# EAGLE schematic ellipticlock-display-r3 (EAGLE 5.12)

## Sheet 1 of 5
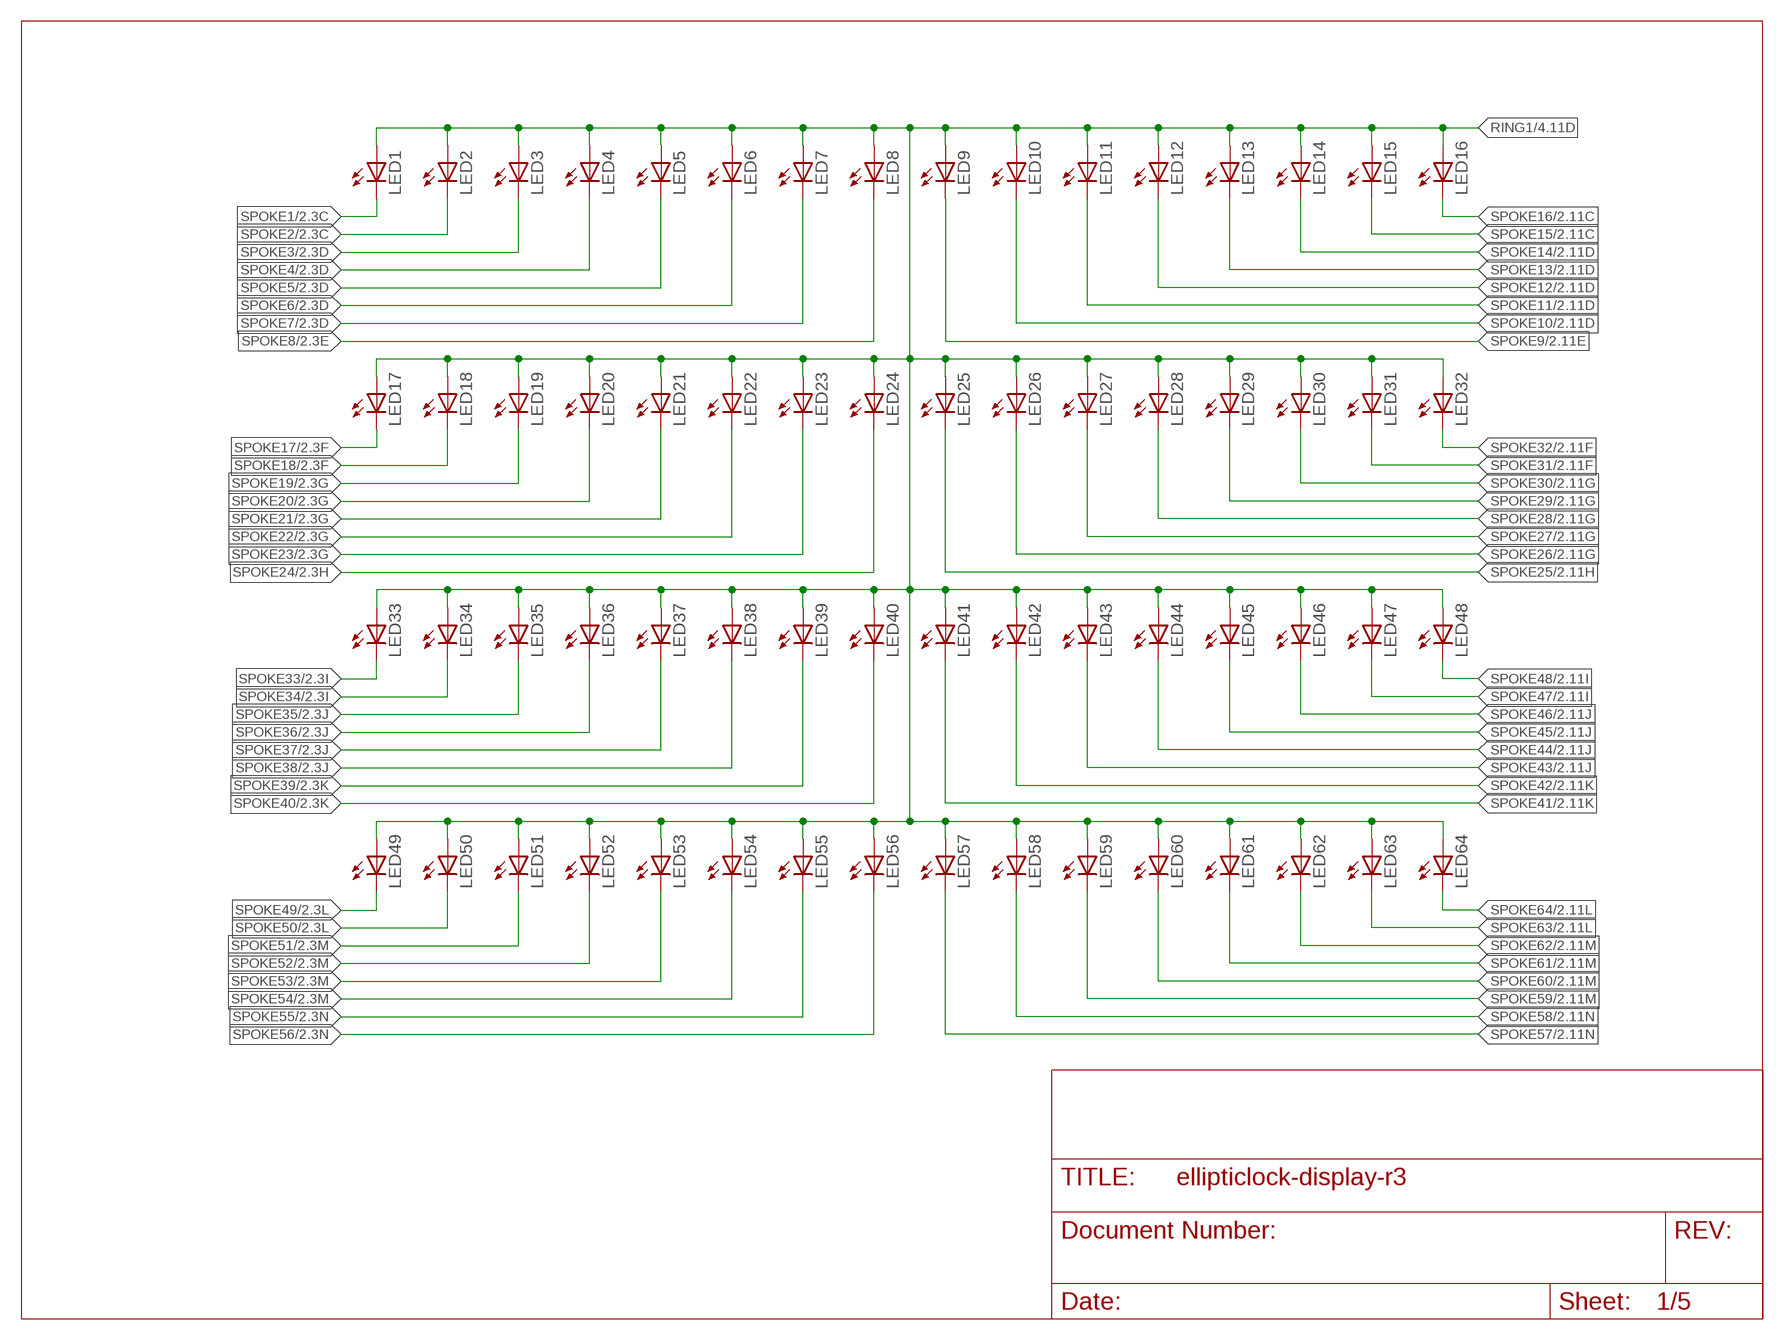
[diagram p0: schematic, sheet 1]

### Parts
LED1  LEDCHIPLED_0603  [CHIPLED_0603]
LED2  LEDCHIPLED_0603  [CHIPLED_0603]
LED3  LEDCHIPLED_0603  [CHIPLED_0603]
LED4  LEDCHIPLED_0603  [CHIPLED_0603]
LED5  LEDCHIPLED_0603  [CHIPLED_0603]
LED6  LEDCHIPLED_0603  [CHIPLED_0603]
LED7  LEDCHIPLED_0603  [CHIPLED_0603]
LED8  LEDCHIPLED_0603  [CHIPLED_0603]
LED9  LEDCHIPLED_0603  [CHIPLED_0603]
LED10  LEDCHIPLED_0603  [CHIPLED_0603]
LED11  LEDCHIPLED_0603  [CHIPLED_0603]
LED12  LEDCHIPLED_0603  [CHIPLED_0603]
LED13  LEDCHIPLED_0603  [CHIPLED_0603]
LED14  LEDCHIPLED_0603  [CHIPLED_0603]
LED15  LEDCHIPLED_0603  [CHIPLED_0603]
LED16  LEDCHIPLED_0603  [CHIPLED_0603]
LED17  LEDCHIPLED_0603  [CHIPLED_0603]
LED18  LEDCHIPLED_0603  [CHIPLED_0603]
LED19  LEDCHIPLED_0603  [CHIPLED_0603]
LED20  LEDCHIPLED_0603  [CHIPLED_0603]
LED21  LEDCHIPLED_0603  [CHIPLED_0603]
LED22  LEDCHIPLED_0603  [CHIPLED_0603]
LED23  LEDCHIPLED_0603  [CHIPLED_0603]
LED24  LEDCHIPLED_0603  [CHIPLED_0603]
LED25  LEDCHIPLED_0603  [CHIPLED_0603]
LED26  LEDCHIPLED_0603  [CHIPLED_0603]
LED27  LEDCHIPLED_0603  [CHIPLED_0603]
LED28  LEDCHIPLED_0603  [CHIPLED_0603]
LED29  LEDCHIPLED_0603  [CHIPLED_0603]
LED30  LEDCHIPLED_0603  [CHIPLED_0603]
LED31  LEDCHIPLED_0603  [CHIPLED_0603]
LED32  LEDCHIPLED_0603  [CHIPLED_0603]
LED33  LEDCHIPLED_0603  [CHIPLED_0603]
LED34  LEDCHIPLED_0603  [CHIPLED_0603]
LED35  LEDCHIPLED_0603  [CHIPLED_0603]
LED36  LEDCHIPLED_0603  [CHIPLED_0603]
LED37  LEDCHIPLED_0603  [CHIPLED_0603]
LED38  LEDCHIPLED_0603  [CHIPLED_0603]
LED39  LEDCHIPLED_0603  [CHIPLED_0603]
LED40  LEDCHIPLED_0603  [CHIPLED_0603]
LED41  LEDCHIPLED_0603  [CHIPLED_0603]
LED42  LEDCHIPLED_0603  [CHIPLED_0603]
LED43  LEDCHIPLED_0603  [CHIPLED_0603]
LED44  LEDCHIPLED_0603  [CHIPLED_0603]
LED45  LEDCHIPLED_0603  [CHIPLED_0603]
LED46  LEDCHIPLED_0603  [CHIPLED_0603]
LED47  LEDCHIPLED_0603  [CHIPLED_0603]
LED48  LEDCHIPLED_0603  [CHIPLED_0603]
LED49  LEDCHIPLED_0603  [CHIPLED_0603]
LED50  LEDCHIPLED_0603  [CHIPLED_0603]
LED51  LEDCHIPLED_0603  [CHIPLED_0603]
LED52  LEDCHIPLED_0603  [CHIPLED_0603]
LED53  LEDCHIPLED_0603  [CHIPLED_0603]
LED54  LEDCHIPLED_0603  [CHIPLED_0603]
LED55  LEDCHIPLED_0603  [CHIPLED_0603]
LED56  LEDCHIPLED_0603  [CHIPLED_0603]
LED57  LEDCHIPLED_0603  [CHIPLED_0603]
LED58  LEDCHIPLED_0603  [CHIPLED_0603]
LED59  LEDCHIPLED_0603  [CHIPLED_0603]
LED60  LEDCHIPLED_0603  [CHIPLED_0603]
LED61  LEDCHIPLED_0603  [CHIPLED_0603]
LED62  LEDCHIPLED_0603  [CHIPLED_0603]
LED63  LEDCHIPLED_0603  [CHIPLED_0603]
LED64  LEDCHIPLED_0603  [CHIPLED_0603]

### Nets
RING1: LED1.A LED2.A LED3.A LED4.A LED5.A LED6.A LED7.A LED8.A LED9.A LED10.A LED11.A LED12.A LED13.A LED14.A LED15.A LED16.A LED17.A LED18.A LED19.A LED20.A LED21.A LED22.A LED23.A LED24.A LED25.A LED26.A LED27.A LED28.A LED29.A LED30.A LED31.A LED32.A LED33.A LED34.A LED35.A LED36.A LED37.A LED38.A LED39.A LED40.A LED41.A LED42.A LED43.A LED44.A LED45.A LED46.A LED47.A LED48.A LED49.A LED50.A LED51.A LED52.A LED53.A LED54.A LED55.A LED56.A LED57.A LED58.A LED59.A LED60.A LED61.A LED62.A LED63.A LED64.A ; also sheet 4
SPOKE1: LED1.C ; also sheet 2,3,4
SPOKE2: LED2.C ; also sheet 2,3,4
SPOKE3: LED3.C ; also sheet 2,3,4
SPOKE4: LED4.C ; also sheet 2,3,4
SPOKE5: LED5.C ; also sheet 2,3,4
SPOKE6: LED6.C ; also sheet 2,3,4
SPOKE7: LED7.C ; also sheet 2,3,4
SPOKE8: LED8.C ; also sheet 2,3,4
SPOKE9: LED9.C ; also sheet 2,3,4
SPOKE10: LED10.C ; also sheet 2,3,4
SPOKE11: LED11.C ; also sheet 2,3,4
SPOKE12: LED12.C ; also sheet 2,3,4
SPOKE13: LED13.C ; also sheet 2,3,4
SPOKE14: LED14.C ; also sheet 2,3,4
SPOKE15: LED15.C ; also sheet 2,3,4
SPOKE16: LED16.C ; also sheet 2,3,4
SPOKE17: LED17.C ; also sheet 2,3,4
SPOKE18: LED18.C ; also sheet 2,3,4
SPOKE19: LED19.C ; also sheet 2,3,4
SPOKE20: LED20.C ; also sheet 2,3,4
SPOKE21: LED21.C ; also sheet 2,3,4
SPOKE22: LED22.C ; also sheet 2,3,4
SPOKE23: LED23.C ; also sheet 2,3,4
SPOKE24: LED24.C ; also sheet 2,3,4
SPOKE25: LED25.C ; also sheet 2,3,4
SPOKE26: LED26.C ; also sheet 2,3,4
SPOKE27: LED27.C ; also sheet 2,3,4
SPOKE28: LED28.C ; also sheet 2,3,4
SPOKE29: LED29.C ; also sheet 2,3,4
SPOKE30: LED30.C ; also sheet 2,3,4
SPOKE31: LED31.C ; also sheet 2,3,4
SPOKE32: LED32.C ; also sheet 2,3,4
SPOKE33: LED33.C ; also sheet 2,3,4
SPOKE34: LED34.C ; also sheet 2,3,4
SPOKE35: LED35.C ; also sheet 2,3,4
SPOKE36: LED36.C ; also sheet 2,3,4
SPOKE37: LED37.C ; also sheet 2,3,4
SPOKE38: LED38.C ; also sheet 2,3,4
SPOKE39: LED39.C ; also sheet 2,3,4
SPOKE40: LED40.C ; also sheet 2,3,4
SPOKE41: LED41.C ; also sheet 2,3,4
SPOKE42: LED42.C ; also sheet 2,3,4
SPOKE43: LED43.C ; also sheet 2,3,4
SPOKE44: LED44.C ; also sheet 2,3,4
SPOKE45: LED45.C ; also sheet 2,3,4
SPOKE46: LED46.C ; also sheet 2,3,4
SPOKE47: LED47.C ; also sheet 2,3,4
SPOKE48: LED48.C ; also sheet 2,3,4
SPOKE49: LED49.C ; also sheet 2,3,4
SPOKE50: LED50.C ; also sheet 2,3,4
SPOKE51: LED51.C ; also sheet 2,3,4
SPOKE52: LED52.C ; also sheet 2,3,4
SPOKE53: LED53.C ; also sheet 2,3,4
SPOKE54: LED54.C ; also sheet 2,3,4
SPOKE55: LED55.C ; also sheet 2,3,4
SPOKE56: LED56.C ; also sheet 2,3,4
SPOKE57: LED57.C ; also sheet 2,3,4
SPOKE58: LED58.C ; also sheet 2,3,4
SPOKE59: LED59.C ; also sheet 2,3,4
SPOKE60: LED60.C ; also sheet 2,3,4
SPOKE61: LED61.C ; also sheet 2,3,4
SPOKE62: LED62.C ; also sheet 2,3,4
SPOKE63: LED63.C ; also sheet 2,3,4
SPOKE64: LED64.C ; also sheet 2,3,4

## Sheet 2 of 5
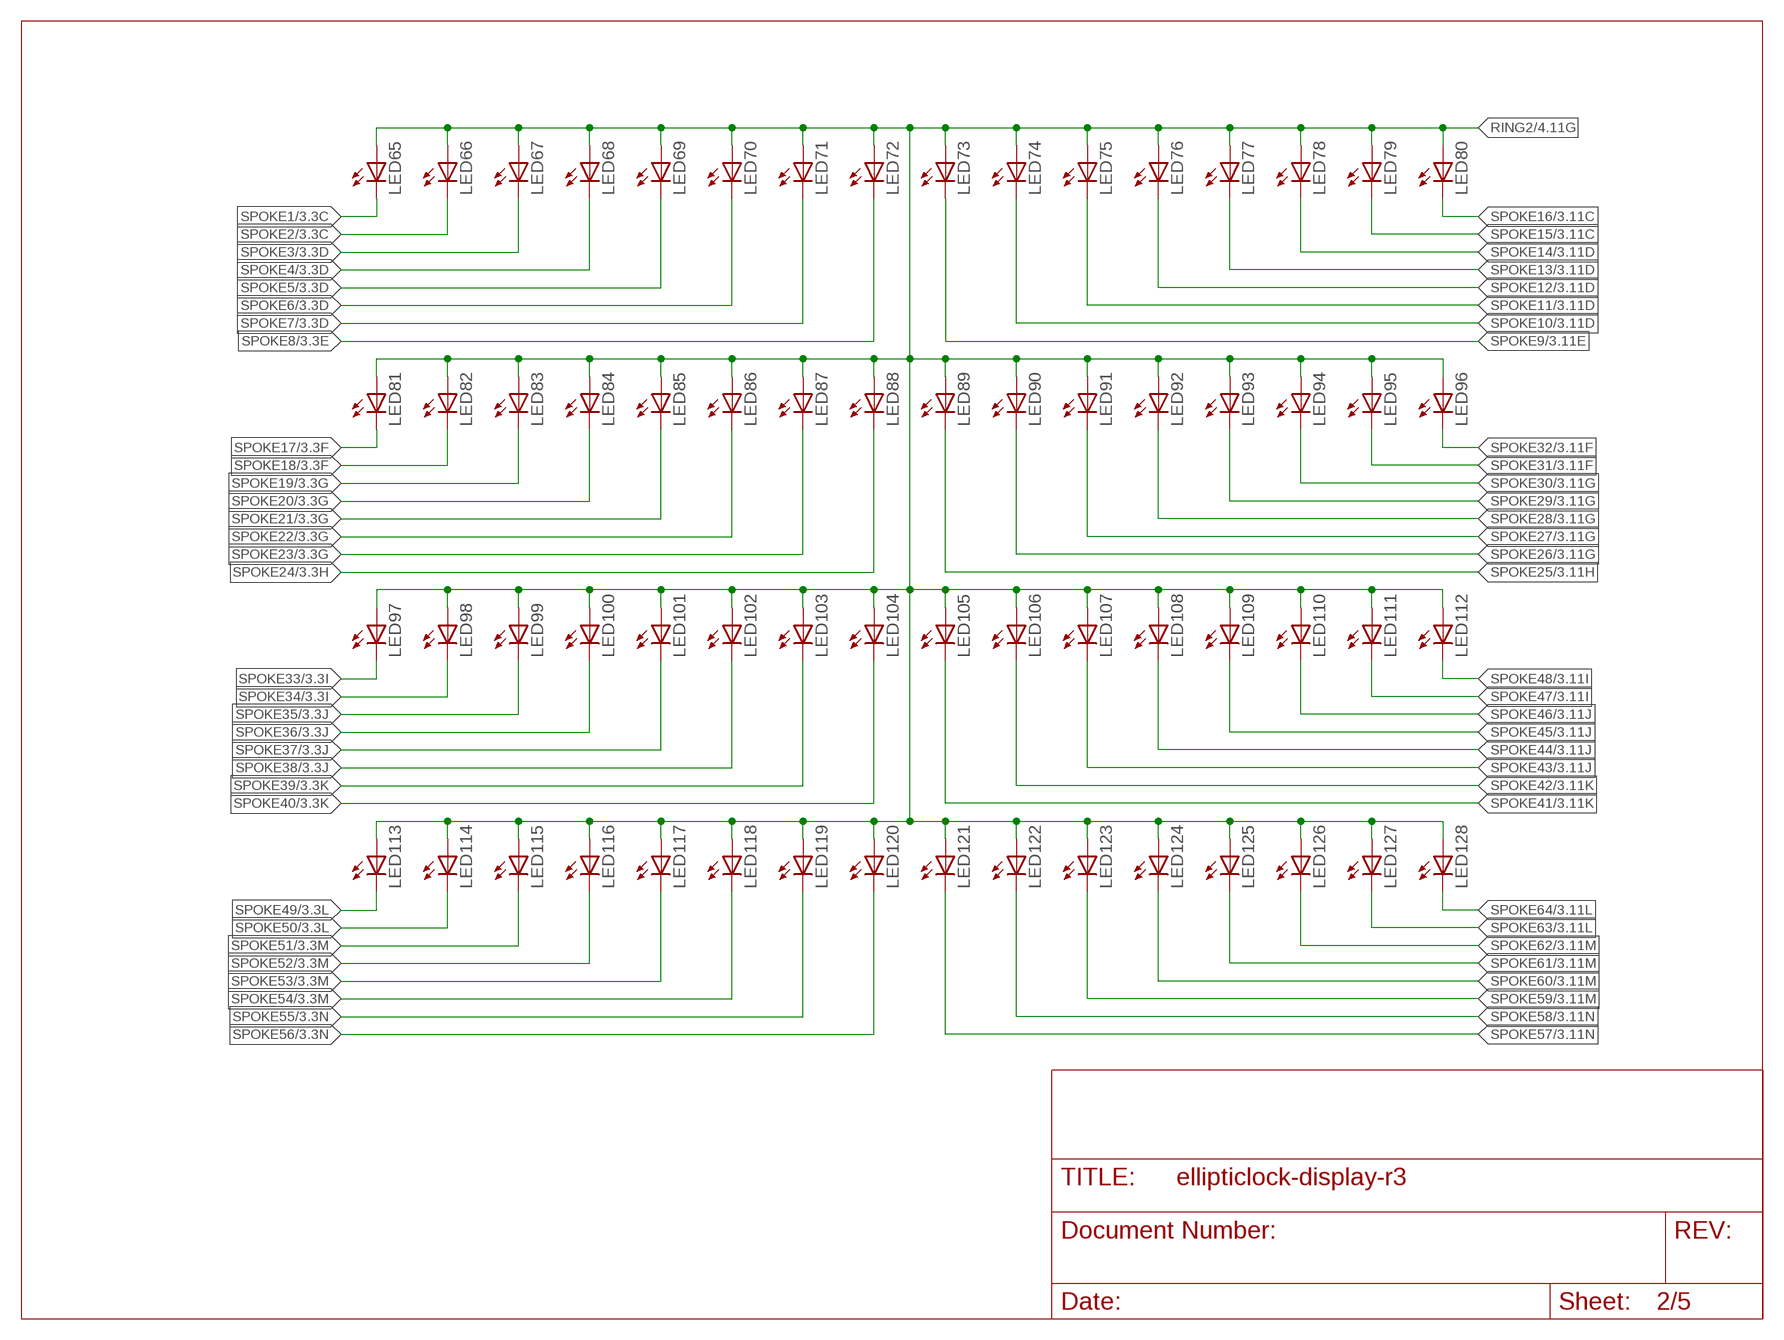
[diagram p1: schematic, sheet 2]

### Parts
LED65  LEDCHIPLED_0603  [CHIPLED_0603]
LED66  LEDCHIPLED_0603  [CHIPLED_0603]
LED67  LEDCHIPLED_0603  [CHIPLED_0603]
LED68  LEDCHIPLED_0603  [CHIPLED_0603]
LED69  LEDCHIPLED_0603  [CHIPLED_0603]
LED70  LEDCHIPLED_0603  [CHIPLED_0603]
LED71  LEDCHIPLED_0603  [CHIPLED_0603]
LED72  LEDCHIPLED_0603  [CHIPLED_0603]
LED73  LEDCHIPLED_0603  [CHIPLED_0603]
LED74  LEDCHIPLED_0603  [CHIPLED_0603]
LED75  LEDCHIPLED_0603  [CHIPLED_0603]
LED76  LEDCHIPLED_0603  [CHIPLED_0603]
LED77  LEDCHIPLED_0603  [CHIPLED_0603]
LED78  LEDCHIPLED_0603  [CHIPLED_0603]
LED79  LEDCHIPLED_0603  [CHIPLED_0603]
LED80  LEDCHIPLED_0603  [CHIPLED_0603]
LED81  LEDCHIPLED_0603  [CHIPLED_0603]
LED82  LEDCHIPLED_0603  [CHIPLED_0603]
LED83  LEDCHIPLED_0603  [CHIPLED_0603]
LED84  LEDCHIPLED_0603  [CHIPLED_0603]
LED85  LEDCHIPLED_0603  [CHIPLED_0603]
LED86  LEDCHIPLED_0603  [CHIPLED_0603]
LED87  LEDCHIPLED_0603  [CHIPLED_0603]
LED88  LEDCHIPLED_0603  [CHIPLED_0603]
LED89  LEDCHIPLED_0603  [CHIPLED_0603]
LED90  LEDCHIPLED_0603  [CHIPLED_0603]
LED91  LEDCHIPLED_0603  [CHIPLED_0603]
LED92  LEDCHIPLED_0603  [CHIPLED_0603]
LED93  LEDCHIPLED_0603  [CHIPLED_0603]
LED94  LEDCHIPLED_0603  [CHIPLED_0603]
LED95  LEDCHIPLED_0603  [CHIPLED_0603]
LED96  LEDCHIPLED_0603  [CHIPLED_0603]
LED97  LEDCHIPLED_0603  [CHIPLED_0603]
LED98  LEDCHIPLED_0603  [CHIPLED_0603]
LED99  LEDCHIPLED_0603  [CHIPLED_0603]
LED100  LEDCHIPLED_0603  [CHIPLED_0603]
LED101  LEDCHIPLED_0603  [CHIPLED_0603]
LED102  LEDCHIPLED_0603  [CHIPLED_0603]
LED103  LEDCHIPLED_0603  [CHIPLED_0603]
LED104  LEDCHIPLED_0603  [CHIPLED_0603]
LED105  LEDCHIPLED_0603  [CHIPLED_0603]
LED106  LEDCHIPLED_0603  [CHIPLED_0603]
LED107  LEDCHIPLED_0603  [CHIPLED_0603]
LED108  LEDCHIPLED_0603  [CHIPLED_0603]
LED109  LEDCHIPLED_0603  [CHIPLED_0603]
LED110  LEDCHIPLED_0603  [CHIPLED_0603]
LED111  LEDCHIPLED_0603  [CHIPLED_0603]
LED112  LEDCHIPLED_0603  [CHIPLED_0603]
LED113  LEDCHIPLED_0603  [CHIPLED_0603]
LED114  LEDCHIPLED_0603  [CHIPLED_0603]
LED115  LEDCHIPLED_0603  [CHIPLED_0603]
LED116  LEDCHIPLED_0603  [CHIPLED_0603]
LED117  LEDCHIPLED_0603  [CHIPLED_0603]
LED118  LEDCHIPLED_0603  [CHIPLED_0603]
LED119  LEDCHIPLED_0603  [CHIPLED_0603]
LED120  LEDCHIPLED_0603  [CHIPLED_0603]
LED121  LEDCHIPLED_0603  [CHIPLED_0603]
LED122  LEDCHIPLED_0603  [CHIPLED_0603]
LED123  LEDCHIPLED_0603  [CHIPLED_0603]
LED124  LEDCHIPLED_0603  [CHIPLED_0603]
LED125  LEDCHIPLED_0603  [CHIPLED_0603]
LED126  LEDCHIPLED_0603  [CHIPLED_0603]
LED127  LEDCHIPLED_0603  [CHIPLED_0603]
LED128  LEDCHIPLED_0603  [CHIPLED_0603]

### Nets
RING2: LED65.A LED66.A LED67.A LED68.A LED69.A LED70.A LED71.A LED72.A LED73.A LED74.A LED75.A LED76.A LED77.A LED78.A LED79.A LED80.A LED81.A LED82.A LED83.A LED84.A LED85.A LED86.A LED87.A LED88.A LED89.A LED90.A LED91.A LED92.A LED93.A LED94.A LED95.A LED96.A LED97.A LED98.A LED99.A LED100.A LED101.A LED102.A LED103.A LED104.A LED105.A LED106.A LED107.A LED108.A LED109.A LED110.A LED111.A LED112.A LED113.A LED114.A LED115.A LED116.A LED117.A LED118.A LED119.A LED120.A LED121.A LED122.A LED123.A LED124.A LED125.A LED126.A LED127.A LED128.A ; also sheet 4
SPOKE1: LED65.C ; also sheet 1,3,4
SPOKE2: LED66.C ; also sheet 1,3,4
SPOKE3: LED67.C ; also sheet 1,3,4
SPOKE4: LED68.C ; also sheet 1,3,4
SPOKE5: LED69.C ; also sheet 1,3,4
SPOKE6: LED70.C ; also sheet 1,3,4
SPOKE7: LED71.C ; also sheet 1,3,4
SPOKE8: LED72.C ; also sheet 1,3,4
SPOKE9: LED73.C ; also sheet 1,3,4
SPOKE10: LED74.C ; also sheet 1,3,4
SPOKE11: LED75.C ; also sheet 1,3,4
SPOKE12: LED76.C ; also sheet 1,3,4
SPOKE13: LED77.C ; also sheet 1,3,4
SPOKE14: LED78.C ; also sheet 1,3,4
SPOKE15: LED79.C ; also sheet 1,3,4
SPOKE16: LED80.C ; also sheet 1,3,4
SPOKE17: LED81.C ; also sheet 1,3,4
SPOKE18: LED82.C ; also sheet 1,3,4
SPOKE19: LED83.C ; also sheet 1,3,4
SPOKE20: LED84.C ; also sheet 1,3,4
SPOKE21: LED85.C ; also sheet 1,3,4
SPOKE22: LED86.C ; also sheet 1,3,4
SPOKE23: LED87.C ; also sheet 1,3,4
SPOKE24: LED88.C ; also sheet 1,3,4
SPOKE25: LED89.C ; also sheet 1,3,4
SPOKE26: LED90.C ; also sheet 1,3,4
SPOKE27: LED91.C ; also sheet 1,3,4
SPOKE28: LED92.C ; also sheet 1,3,4
SPOKE29: LED93.C ; also sheet 1,3,4
SPOKE30: LED94.C ; also sheet 1,3,4
SPOKE31: LED95.C ; also sheet 1,3,4
SPOKE32: LED96.C ; also sheet 1,3,4
SPOKE33: LED97.C ; also sheet 1,3,4
SPOKE34: LED98.C ; also sheet 1,3,4
SPOKE35: LED99.C ; also sheet 1,3,4
SPOKE36: LED100.C ; also sheet 1,3,4
SPOKE37: LED101.C ; also sheet 1,3,4
SPOKE38: LED102.C ; also sheet 1,3,4
SPOKE39: LED103.C ; also sheet 1,3,4
SPOKE40: LED104.C ; also sheet 1,3,4
SPOKE41: LED105.C ; also sheet 1,3,4
SPOKE42: LED106.C ; also sheet 1,3,4
SPOKE43: LED107.C ; also sheet 1,3,4
SPOKE44: LED108.C ; also sheet 1,3,4
SPOKE45: LED109.C ; also sheet 1,3,4
SPOKE46: LED110.C ; also sheet 1,3,4
SPOKE47: LED111.C ; also sheet 1,3,4
SPOKE48: LED112.C ; also sheet 1,3,4
SPOKE49: LED113.C ; also sheet 1,3,4
SPOKE50: LED114.C ; also sheet 1,3,4
SPOKE51: LED115.C ; also sheet 1,3,4
SPOKE52: LED116.C ; also sheet 1,3,4
SPOKE53: LED117.C ; also sheet 1,3,4
SPOKE54: LED118.C ; also sheet 1,3,4
SPOKE55: LED119.C ; also sheet 1,3,4
SPOKE56: LED120.C ; also sheet 1,3,4
SPOKE57: LED121.C ; also sheet 1,3,4
SPOKE58: LED122.C ; also sheet 1,3,4
SPOKE59: LED123.C ; also sheet 1,3,4
SPOKE60: LED124.C ; also sheet 1,3,4
SPOKE61: LED125.C ; also sheet 1,3,4
SPOKE62: LED126.C ; also sheet 1,3,4
SPOKE63: LED127.C ; also sheet 1,3,4
SPOKE64: LED128.C ; also sheet 1,3,4

## Sheet 3 of 5
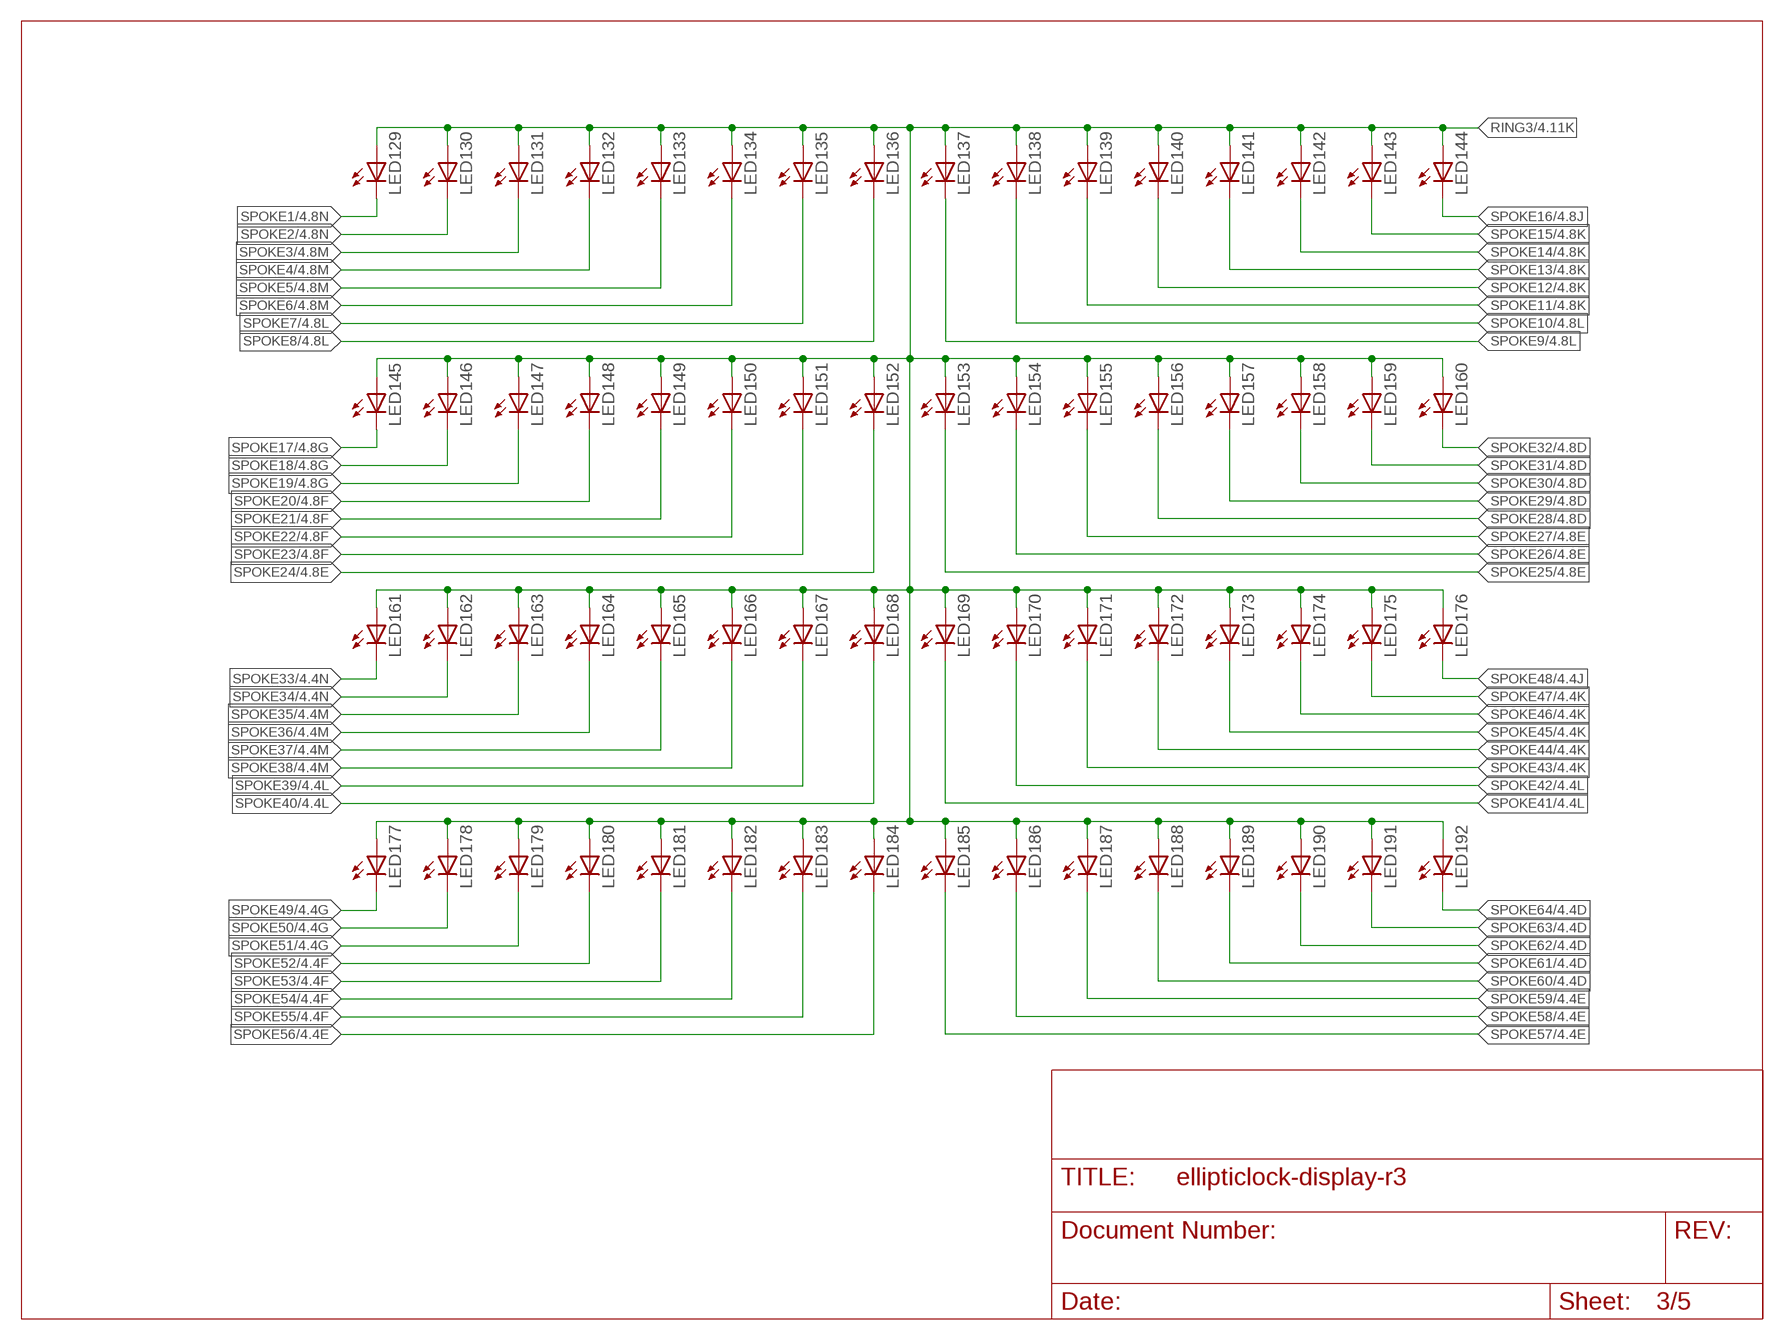
[diagram p2: schematic, sheet 3]

### Parts
LED129  LEDCHIPLED_0603  [CHIPLED_0603]
LED130  LEDCHIPLED_0603  [CHIPLED_0603]
LED131  LEDCHIPLED_0603  [CHIPLED_0603]
LED132  LEDCHIPLED_0603  [CHIPLED_0603]
LED133  LEDCHIPLED_0603  [CHIPLED_0603]
LED134  LEDCHIPLED_0603  [CHIPLED_0603]
LED135  LEDCHIPLED_0603  [CHIPLED_0603]
LED136  LEDCHIPLED_0603  [CHIPLED_0603]
LED137  LEDCHIPLED_0603  [CHIPLED_0603]
LED138  LEDCHIPLED_0603  [CHIPLED_0603]
LED139  LEDCHIPLED_0603  [CHIPLED_0603]
LED140  LEDCHIPLED_0603  [CHIPLED_0603]
LED141  LEDCHIPLED_0603  [CHIPLED_0603]
LED142  LEDCHIPLED_0603  [CHIPLED_0603]
LED143  LEDCHIPLED_0603  [CHIPLED_0603]
LED144  LEDCHIPLED_0603  [CHIPLED_0603]
LED145  LEDCHIPLED_0603  [CHIPLED_0603]
LED146  LEDCHIPLED_0603  [CHIPLED_0603]
LED147  LEDCHIPLED_0603  [CHIPLED_0603]
LED148  LEDCHIPLED_0603  [CHIPLED_0603]
LED149  LEDCHIPLED_0603  [CHIPLED_0603]
LED150  LEDCHIPLED_0603  [CHIPLED_0603]
LED151  LEDCHIPLED_0603  [CHIPLED_0603]
LED152  LEDCHIPLED_0603  [CHIPLED_0603]
LED153  LEDCHIPLED_0603  [CHIPLED_0603]
LED154  LEDCHIPLED_0603  [CHIPLED_0603]
LED155  LEDCHIPLED_0603  [CHIPLED_0603]
LED156  LEDCHIPLED_0603  [CHIPLED_0603]
LED157  LEDCHIPLED_0603  [CHIPLED_0603]
LED158  LEDCHIPLED_0603  [CHIPLED_0603]
LED159  LEDCHIPLED_0603  [CHIPLED_0603]
LED160  LEDCHIPLED_0603  [CHIPLED_0603]
LED161  LEDCHIPLED_0603  [CHIPLED_0603]
LED162  LEDCHIPLED_0603  [CHIPLED_0603]
LED163  LEDCHIPLED_0603  [CHIPLED_0603]
LED164  LEDCHIPLED_0603  [CHIPLED_0603]
LED165  LEDCHIPLED_0603  [CHIPLED_0603]
LED166  LEDCHIPLED_0603  [CHIPLED_0603]
LED167  LEDCHIPLED_0603  [CHIPLED_0603]
LED168  LEDCHIPLED_0603  [CHIPLED_0603]
LED169  LEDCHIPLED_0603  [CHIPLED_0603]
LED170  LEDCHIPLED_0603  [CHIPLED_0603]
LED171  LEDCHIPLED_0603  [CHIPLED_0603]
LED172  LEDCHIPLED_0603  [CHIPLED_0603]
LED173  LEDCHIPLED_0603  [CHIPLED_0603]
LED174  LEDCHIPLED_0603  [CHIPLED_0603]
LED175  LEDCHIPLED_0603  [CHIPLED_0603]
LED176  LEDCHIPLED_0603  [CHIPLED_0603]
LED177  LEDCHIPLED_0603  [CHIPLED_0603]
LED178  LEDCHIPLED_0603  [CHIPLED_0603]
LED179  LEDCHIPLED_0603  [CHIPLED_0603]
LED180  LEDCHIPLED_0603  [CHIPLED_0603]
LED181  LEDCHIPLED_0603  [CHIPLED_0603]
LED182  LEDCHIPLED_0603  [CHIPLED_0603]
LED183  LEDCHIPLED_0603  [CHIPLED_0603]
LED184  LEDCHIPLED_0603  [CHIPLED_0603]
LED185  LEDCHIPLED_0603  [CHIPLED_0603]
LED186  LEDCHIPLED_0603  [CHIPLED_0603]
LED187  LEDCHIPLED_0603  [CHIPLED_0603]
LED188  LEDCHIPLED_0603  [CHIPLED_0603]
LED189  LEDCHIPLED_0603  [CHIPLED_0603]
LED190  LEDCHIPLED_0603  [CHIPLED_0603]
LED191  LEDCHIPLED_0603  [CHIPLED_0603]
LED192  LEDCHIPLED_0603  [CHIPLED_0603]

### Nets
RING3: LED129.A LED130.A LED131.A LED132.A LED133.A LED134.A LED135.A LED136.A LED137.A LED138.A LED139.A LED140.A LED141.A LED142.A LED143.A LED144.A LED145.A LED146.A LED147.A LED148.A LED149.A LED150.A LED151.A LED152.A LED153.A LED154.A LED155.A LED156.A LED157.A LED158.A LED159.A LED160.A LED161.A LED162.A LED163.A LED164.A LED165.A LED166.A LED167.A LED168.A LED169.A LED170.A LED171.A LED172.A LED173.A LED174.A LED175.A LED176.A LED177.A LED178.A LED179.A LED180.A LED181.A LED182.A LED183.A LED184.A LED185.A LED186.A LED187.A LED188.A LED189.A LED190.A LED191.A LED192.A ; also sheet 4
SPOKE1: LED129.C ; also sheet 1,2,4
SPOKE2: LED130.C ; also sheet 1,2,4
SPOKE3: LED131.C ; also sheet 1,2,4
SPOKE4: LED132.C ; also sheet 1,2,4
SPOKE5: LED133.C ; also sheet 1,2,4
SPOKE6: LED134.C ; also sheet 1,2,4
SPOKE7: LED135.C ; also sheet 1,2,4
SPOKE8: LED136.C ; also sheet 1,2,4
SPOKE9: LED137.C ; also sheet 1,2,4
SPOKE10: LED138.C ; also sheet 1,2,4
SPOKE11: LED139.C ; also sheet 1,2,4
SPOKE12: LED140.C ; also sheet 1,2,4
SPOKE13: LED141.C ; also sheet 1,2,4
SPOKE14: LED142.C ; also sheet 1,2,4
SPOKE15: LED143.C ; also sheet 1,2,4
SPOKE16: LED144.C ; also sheet 1,2,4
SPOKE17: LED145.C ; also sheet 1,2,4
SPOKE18: LED146.C ; also sheet 1,2,4
SPOKE19: LED147.C ; also sheet 1,2,4
SPOKE20: LED148.C ; also sheet 1,2,4
SPOKE21: LED149.C ; also sheet 1,2,4
SPOKE22: LED150.C ; also sheet 1,2,4
SPOKE23: LED151.C ; also sheet 1,2,4
SPOKE24: LED152.C ; also sheet 1,2,4
SPOKE25: LED153.C ; also sheet 1,2,4
SPOKE26: LED154.C ; also sheet 1,2,4
SPOKE27: LED155.C ; also sheet 1,2,4
SPOKE28: LED156.C ; also sheet 1,2,4
SPOKE29: LED157.C ; also sheet 1,2,4
SPOKE30: LED158.C ; also sheet 1,2,4
SPOKE31: LED159.C ; also sheet 1,2,4
SPOKE32: LED160.C ; also sheet 1,2,4
SPOKE33: LED161.C ; also sheet 1,2,4
SPOKE34: LED162.C ; also sheet 1,2,4
SPOKE35: LED163.C ; also sheet 1,2,4
SPOKE36: LED164.C ; also sheet 1,2,4
SPOKE37: LED165.C ; also sheet 1,2,4
SPOKE38: LED166.C ; also sheet 1,2,4
SPOKE39: LED167.C ; also sheet 1,2,4
SPOKE40: LED168.C ; also sheet 1,2,4
SPOKE41: LED169.C ; also sheet 1,2,4
SPOKE42: LED170.C ; also sheet 1,2,4
SPOKE43: LED171.C ; also sheet 1,2,4
SPOKE44: LED172.C ; also sheet 1,2,4
SPOKE45: LED173.C ; also sheet 1,2,4
SPOKE46: LED174.C ; also sheet 1,2,4
SPOKE47: LED175.C ; also sheet 1,2,4
SPOKE48: LED176.C ; also sheet 1,2,4
SPOKE49: LED177.C ; also sheet 1,2,4
SPOKE50: LED178.C ; also sheet 1,2,4
SPOKE51: LED179.C ; also sheet 1,2,4
SPOKE52: LED180.C ; also sheet 1,2,4
SPOKE53: LED181.C ; also sheet 1,2,4
SPOKE54: LED182.C ; also sheet 1,2,4
SPOKE55: LED183.C ; also sheet 1,2,4
SPOKE56: LED184.C ; also sheet 1,2,4
SPOKE57: LED185.C ; also sheet 1,2,4
SPOKE58: LED186.C ; also sheet 1,2,4
SPOKE59: LED187.C ; also sheet 1,2,4
SPOKE60: LED188.C ; also sheet 1,2,4
SPOKE61: LED189.C ; also sheet 1,2,4
SPOKE62: LED190.C ; also sheet 1,2,4
SPOKE63: LED191.C ; also sheet 1,2,4
SPOKE64: LED192.C ; also sheet 1,2,4

## Sheet 4 of 5
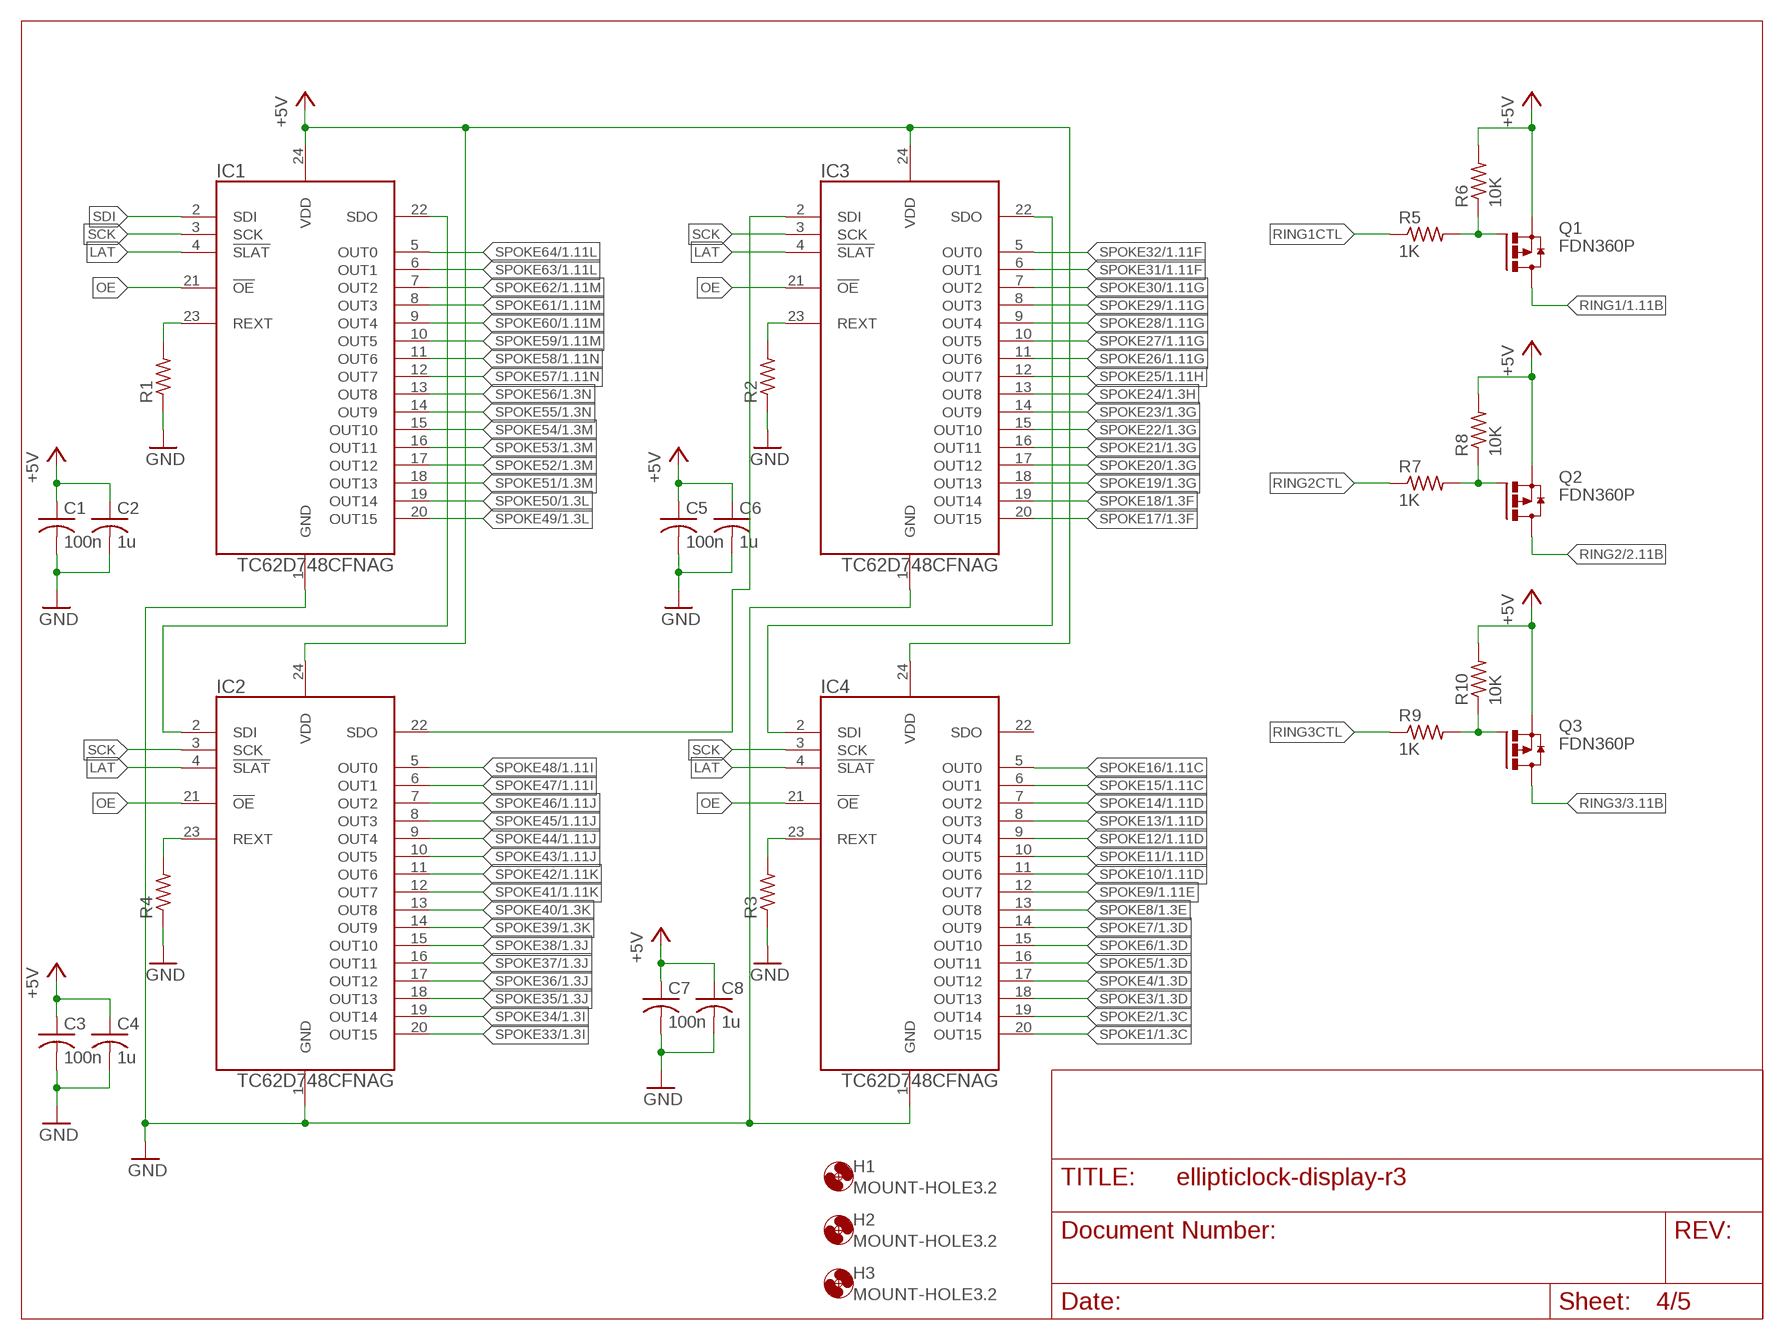
[diagram p3: schematic, sheet 4]

### Parts
C1  100n  C-USC0603  [C0603]
C2  1u  C-USC0603  [C0603]
C3  100n  C-USC0603  [C0603]
C4  1u  C-USC0603  [C0603]
C5  100n  C-USC0603  [C0603]
C6  1u  C-USC0603  [C0603]
C7  100n  C-USC0603  [C0603]
C8  1u  C-USC0603  [C0603]
H1  MOUNT-HOLE3.2  [3,2]
H2  MOUNT-HOLE3.2  [3,2]
H3  MOUNT-HOLE3.2  [3,2]
IC1  TC62D748CFNAG  [SSOP24-0.64]
IC2  TC62D748CFNAG  [SSOP24-0.64]
IC3  TC62D748CFNAG  [SSOP24-0.64]
IC4  TC62D748CFNAG  [SSOP24-0.64]
Q1  FDN360P  [SUPER-SOT3]
Q2  FDN360P  [SUPER-SOT3]
Q3  FDN360P  [SUPER-SOT3]
R1  R-US_R0603  [R0603]
R2  R-US_R0603  [R0603]
R3  R-US_R0603  [R0603]
R4  R-US_R0603  [R0603]
R5  1K  R-US_R0603  [R0603]
R6  10K  R-US_R0603  [R0603]
R7  1K  R-US_R0603  [R0603]
R8  10K  R-US_R0603  [R0603]
R9  1K  R-US_R0603  [R0603]
R10  10K  R-US_R0603  [R0603]

### Nets
+5V: C1.1 C2.1 C3.1 C4.1 C5.1 C6.1 C7.1 C8.1 IC1.24(VDD) IC2.24(VDD) IC3.24(VDD) IC4.24(VDD) Q1.2(S) Q2.2(S) Q3.2(S) R6.2 R8.2 R10.2
GND: C1.2 C2.2 C3.2 C4.2 C5.2 C6.2 C7.2 C8.2 IC1.1(GND) IC2.1(GND) IC3.1(GND) IC4.1(GND) R1.1 R2.1 R3.1 R4.1
LAT: IC1.4(!SLAT) IC2.4(!SLAT) IC3.4(!SLAT) IC4.4(!SLAT)
N$1: IC1.22(SDO) IC2.2(SDI)
N$6: IC3.22(SDO) IC4.2(SDI)
N$7: IC2.22(SDO) IC3.2(SDI)
N$8: IC2.23(REXT) R4.2
N$9: IC4.23(REXT) R3.2
N$10: IC1.23(REXT) R1.2
N$11: IC3.23(REXT) R2.2
N$12: Q1.1(G) R5.2 R6.1
N$28: Q2.1(G) R7.2 R8.1
N$29: Q3.1(G) R9.2 R10.1
OE: IC1.21(!OE) IC2.21(!OE) IC3.21(!OE) IC4.21(!OE)
RING1: Q1.3(D) ; also sheet 1
RING1CTL: R5.1
RING2: Q2.3(D) ; also sheet 2
RING2CTL: R7.1
RING3: Q3.3(D) ; also sheet 3
RING3CTL: R9.1
SCK: IC1.3(SCK) IC2.3(SCK) IC3.3(SCK) IC4.3(SCK)
SDI: IC1.2(SDI)
SPOKE1: IC4.20(OUT15) ; also sheet 1,2,3
SPOKE2: IC4.19(OUT14) ; also sheet 1,2,3
SPOKE3: IC4.18(OUT13) ; also sheet 1,2,3
SPOKE4: IC4.17(OUT12) ; also sheet 1,2,3
SPOKE5: IC4.16(OUT11) ; also sheet 1,2,3
SPOKE6: IC4.15(OUT10) ; also sheet 1,2,3
SPOKE7: IC4.14(OUT9) ; also sheet 1,2,3
SPOKE8: IC4.13(OUT8) ; also sheet 1,2,3
SPOKE9: IC4.12(OUT7) ; also sheet 1,2,3
SPOKE10: IC4.11(OUT6) ; also sheet 1,2,3
SPOKE11: IC4.10(OUT5) ; also sheet 1,2,3
SPOKE12: IC4.9(OUT4) ; also sheet 1,2,3
SPOKE13: IC4.8(OUT3) ; also sheet 1,2,3
SPOKE14: IC4.7(OUT2) ; also sheet 1,2,3
SPOKE15: IC4.6(OUT1) ; also sheet 1,2,3
SPOKE16: IC4.5(OUT0) ; also sheet 1,2,3
SPOKE17: IC3.20(OUT15) ; also sheet 1,2,3
SPOKE18: IC3.19(OUT14) ; also sheet 1,2,3
SPOKE19: IC3.18(OUT13) ; also sheet 1,2,3
SPOKE20: IC3.17(OUT12) ; also sheet 1,2,3
SPOKE21: IC3.16(OUT11) ; also sheet 1,2,3
SPOKE22: IC3.15(OUT10) ; also sheet 1,2,3
SPOKE23: IC3.14(OUT9) ; also sheet 1,2,3
SPOKE24: IC3.13(OUT8) ; also sheet 1,2,3
SPOKE25: IC3.12(OUT7) ; also sheet 1,2,3
SPOKE26: IC3.11(OUT6) ; also sheet 1,2,3
SPOKE27: IC3.10(OUT5) ; also sheet 1,2,3
SPOKE28: IC3.9(OUT4) ; also sheet 1,2,3
SPOKE29: IC3.8(OUT3) ; also sheet 1,2,3
SPOKE30: IC3.7(OUT2) ; also sheet 1,2,3
SPOKE31: IC3.6(OUT1) ; also sheet 1,2,3
SPOKE32: IC3.5(OUT0) ; also sheet 1,2,3
SPOKE33: IC2.20(OUT15) ; also sheet 1,2,3
SPOKE34: IC2.19(OUT14) ; also sheet 1,2,3
SPOKE35: IC2.18(OUT13) ; also sheet 1,2,3
SPOKE36: IC2.17(OUT12) ; also sheet 1,2,3
SPOKE37: IC2.16(OUT11) ; also sheet 1,2,3
SPOKE38: IC2.15(OUT10) ; also sheet 1,2,3
SPOKE39: IC2.14(OUT9) ; also sheet 1,2,3
SPOKE40: IC2.13(OUT8) ; also sheet 1,2,3
SPOKE41: IC2.12(OUT7) ; also sheet 1,2,3
SPOKE42: IC2.11(OUT6) ; also sheet 1,2,3
SPOKE43: IC2.10(OUT5) ; also sheet 1,2,3
SPOKE44: IC2.9(OUT4) ; also sheet 1,2,3
SPOKE45: IC2.8(OUT3) ; also sheet 1,2,3
SPOKE46: IC2.7(OUT2) ; also sheet 1,2,3
SPOKE47: IC2.6(OUT1) ; also sheet 1,2,3
SPOKE48: IC2.5(OUT0) ; also sheet 1,2,3
SPOKE49: IC1.20(OUT15) ; also sheet 1,2,3
SPOKE50: IC1.19(OUT14) ; also sheet 1,2,3
SPOKE51: IC1.18(OUT13) ; also sheet 1,2,3
SPOKE52: IC1.17(OUT12) ; also sheet 1,2,3
SPOKE53: IC1.16(OUT11) ; also sheet 1,2,3
SPOKE54: IC1.15(OUT10) ; also sheet 1,2,3
SPOKE55: IC1.14(OUT9) ; also sheet 1,2,3
SPOKE56: IC1.13(OUT8) ; also sheet 1,2,3
SPOKE57: IC1.12(OUT7) ; also sheet 1,2,3
SPOKE58: IC1.11(OUT6) ; also sheet 1,2,3
SPOKE59: IC1.10(OUT5) ; also sheet 1,2,3
SPOKE60: IC1.9(OUT4) ; also sheet 1,2,3
SPOKE61: IC1.8(OUT3) ; also sheet 1,2,3
SPOKE62: IC1.7(OUT2) ; also sheet 1,2,3
SPOKE63: IC1.6(OUT1) ; also sheet 1,2,3
SPOKE64: IC1.5(OUT0) ; also sheet 1,2,3
Unconnected: IC4.22(SDO)

## Sheet 5 of 5
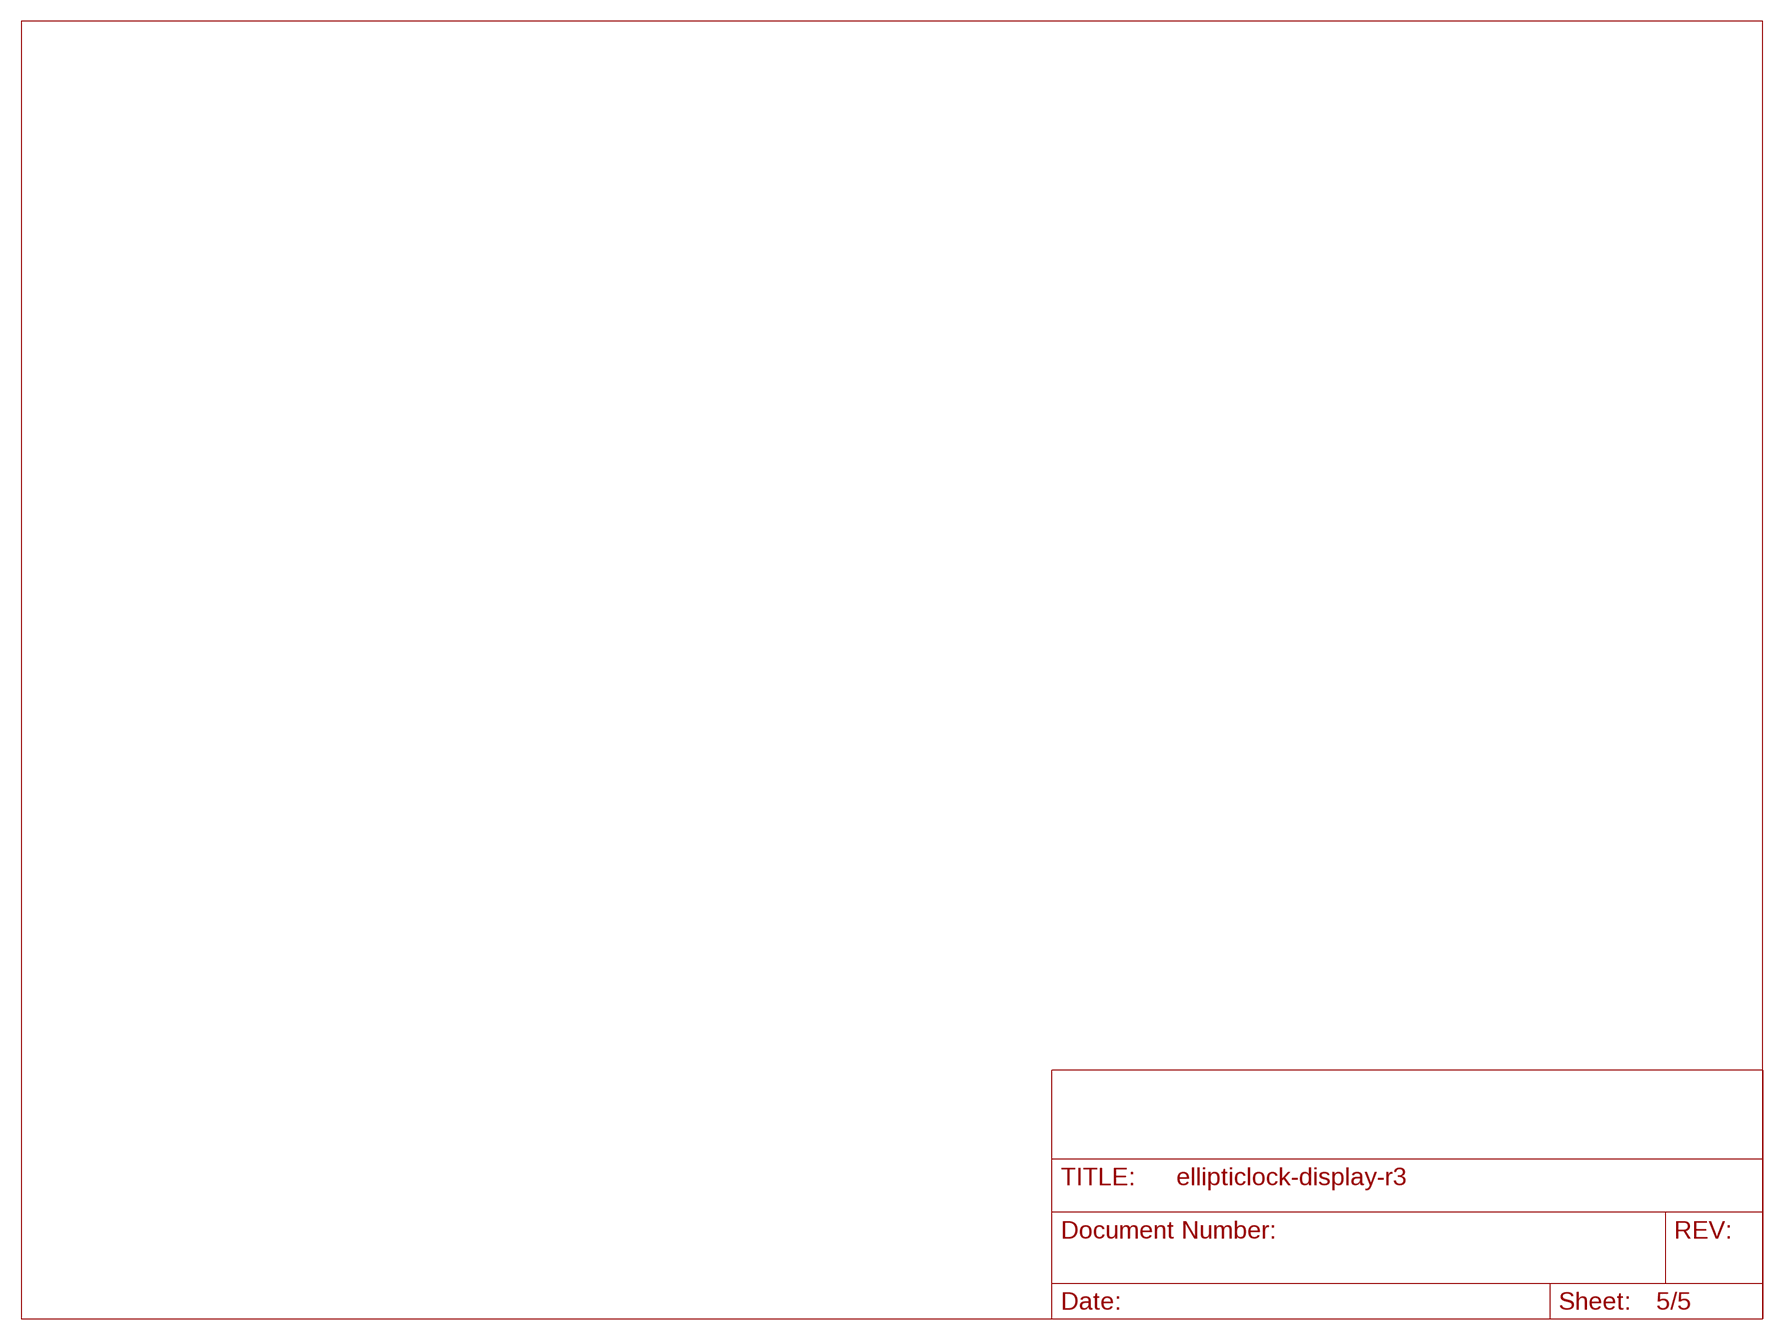
[diagram p4: schematic, sheet 5]

## Library data of the parts
C1-C8 = rcl:C-US: CAPACITOR, American symbol
H1-H3 = holes:MOUNT-HOLE: MOUNTING HOLE with drill center marker
IC1-IC4 = rbg-toshiba-leddriver:TC62D748CFNAG
LED1-LED192 = led:LED: LED OSRAM: - CHIPLED LG R971, LG N971, LY N971, LG Q971, LY Q971, LO R971, LY R971 LH N974, LH R974 LS Q976, LO Q976, LY Q976 LO Q996 - Hyper CHIPLED LW Q18S LB Q993, LB Q99A, LB R99A - SideLED LS A670, LO A670, LY A670, LG A670, LP A670 LB A673, LV A673, LT A673, LW A673 LH A674 LY A675 LS A676, LA A676, LO A676, LY A676, LW A676 LS A679, LY A679, LG A679 - Hyper Micro SIDELED® LS Y876, LA Y876, LO Y876, LY Y876 LT Y87S - SmartLED LW L88C, LW L88S LB L89C, LB L89S, LG L890 LS L89K, LO L89K, LY L89K LS L896, LA L896, LO L896, LY L896 - TOPLED LS T670, LO T670, LY T670, LG T670, LP T670 LSG T670, LSP T670, LSY T670, LOP T670, LYG T670 LG T671, LOG T671, LSG T671 LB T673, LV T673, LT T673, LW T673 LH T674 LS T676, LA T676, LO T676, LY T676, LB T676, LH T676, LSB T676, LW T676 LB T67C, LV T67C, LT T67C, LS T67K, LO T67K, LY T67K, LW E67C LS E67B, LA E67B, LO E67B, LY E67B, LB E67C, LV E67C, LT E67C LW T67C LS T679, LY T679, LG T679 LS T770, LO T770, LY T770, LG T770, LP T770 LB T773, LV T773, LT T773, LW T773 LH T774 LS E675, LA E675, LY E675, LS T675 LS T776, LA T776, LO T776, LY T776, LB T776 LHGB T686 LT T68C, LB T68C - Hyper Mini TOPLED® LB M676 - Mini TOPLED Santana® LG M470 LS M47K, LO M47K, LY M47K Source: http://www.osram.convergy.de LUXEON: - LUMILED® LXK2-PW12-R00, LXK2-PW12-S00, LXK2-PW14-U00, LXK2-PW14-V00 LXK2-PM12-R00, LXK2-PM12-S00, LXK2-PM14-U00 LXK2-PE12-Q00, LXK2-PE12-R00, LXK2-PE12-S00, LXK2-PE14-T00, LXK2-PE14-U00 LXK2-PB12-K00, LXK2-PB12-L00, LXK2-PB12-M00, LXK2-PB14-N00, LXK2-PB14-P00, LXK2-PB14-Q00 LXK2-PR12-L00, LXK2-PR12-M00, LXK2-PR14-Q00, LXK2-PR14-R00 LXK2-PD12-Q00, LXK2-PD12-R00, LXK2-PD12-S00 LXK2-PH12-R00, LXK2-PH12-S00 LXK2-PL12-P00, LXK2-PL12-Q00, LXK2-PL12-R00 Source: www.luxeon.com KINGBRIGHT: KA-3528ASYC Source: www.kingbright.com
Q1-Q3 = transistor-power:FDN360P: Single P-Channel, PowerTrench (R) MOSFET Source: http://www.fairchildsemi.com/ds/FD/FDN360P.pdf
R1-R10 = rcl:R-US_: RESISTOR, American symbol